# EAGLE design AbercrombieBlockage (EAGLE 7.4.0)
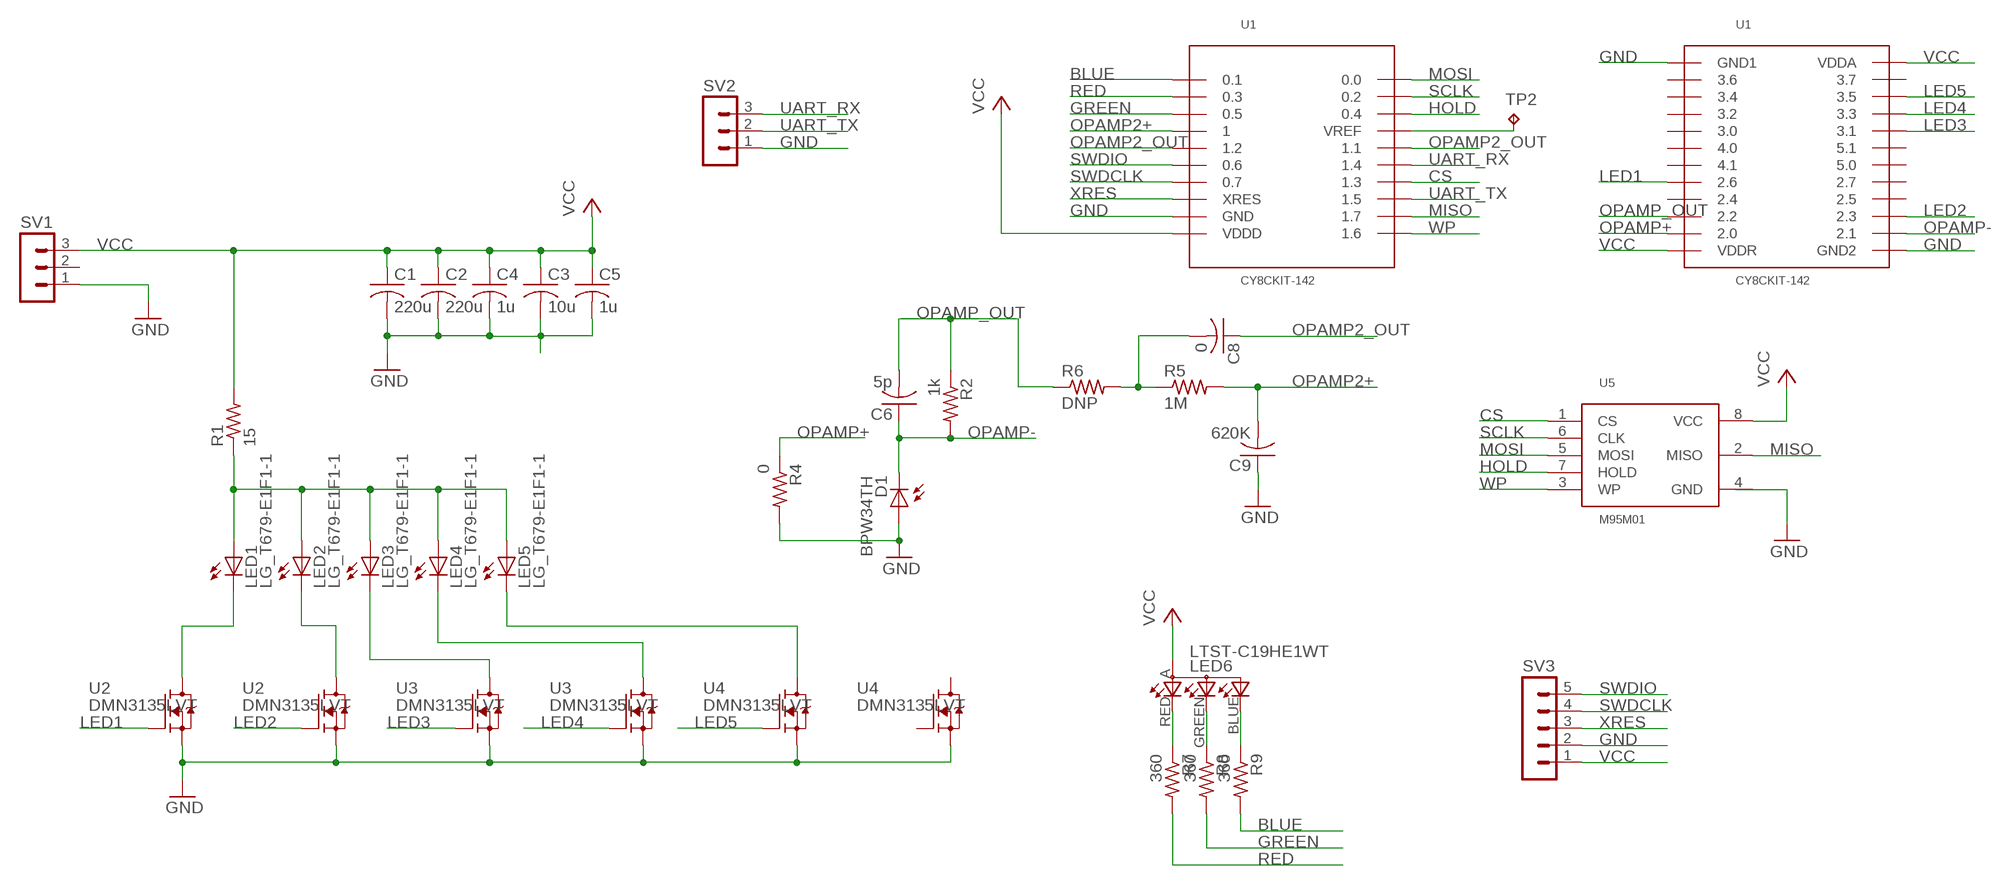
[diagram p0: schematic, sheet 1]

## Parts
C1  220u  C-USC1210  [C1210]
C2  220u  C-USC1210  [C1210]
C3  10u  C-USC1210  [C1210]
C4  1u  C-USC0603  [C0603]
C5  1u  C-USC0603  [C0603]
C6  5p  C-USC0603  [C0603]
C8  0  C-USC0603  [C0603]
C9  620K  C-USC0603  [C0603]
D1  BPW34TH  [BPW34]
LED1  LG_T679-E1F1-1  [PLCC2]
LED2  LG_T679-E1F1-1  [PLCC2]
LED3  LG_T679-E1F1-1  [PLCC2]
LED4  LG_T679-E1F1-1  [PLCC2]
LED5  LG_T679-E1F1-1  [PLCC2]
LED6  LTST-C19HE1WT  [LTST-C19HE1WT]
R1  15  R-US_R2010  [R2010]
R2  1k  R-US_R0603  [R0603]
R4  0  R-US_R0603  [R0603]
R5  1M  R-US_R0603  [R0603]
R6  DNP  R-US_R0603  [R0603]
R7  360  R-US_R0603  [R0603]
R8  360  R-US_R0603  [R0603]
R9  360  R-US_R0603  [R0603]
SV1  MA03-1  [MA03-1]
SV2  MA03-1  [MA03-1]
SV3  MA05-1  [MA05-1]
TP2  TPB1,27  [B1,27]
U1  CY8CKIT-142  [CY8CKIT-142]
U2  DMN3135LVT  [SOT-23-6]
U3  DMN3135LVT  [SOT-23-6]
U4  DMN3135LVT  [SOT-23-6]
U5  M95M01  [SO-08]

## Nets
BLUE: R9.2 U1.0.1
CS: U1.1.3 U5.1(CS)
GND: C1.2 C2.2 C3.2 C4.2 C5.2 C9.1 D1.A R4.2 SV1.1 SV2.1 SV3.2 U1.GND U1.GND1 U1.GND2 U2.2(S2) U2.5(S1) U3.2(S2) U3.5(S1) U4.2(S2) U4.5(S1)
GREEN: R8.2 U1.0.5
HOLD: U1.0.4 U5.7(HOLD)
LED1: U1.2.6 U2.1(G1)
LED2: U1.2.3 U2.3(G2)
LED3: U1.3.1 U3.1(G1)
LED4: U1.3.3 U3.3(G2)
LED5: U1.3.5 U4.1(G1)
MISO: U1.1.7 U5.2(MISO)
MOSI: U1.0.0 U5.5(MOSI)
N$1: LED1.A LED2.A LED3.A LED4.A LED5.A R1.1
N$2: LED1.C U2.6(D1)
N$3: LED2.C U2.4(D2)
N$4: LED3.C U3.6(D1)
N$5: LED4.C U3.4(D2)
N$6: LED5.C U4.6(D1)
N$7: C8.2 R5.1 R6.2
N$9: TP2.TP U1.VREF
N$10: LED6.RED(CRED) R7.1
N$11: LED6.GREEN(CGREEN) R8.1
N$13: LED6.BLUE(CBLUE) R9.1
OPAMP2+: C9.2 R5.2 U1.1
OPAMP2_OUT: C8.1 U1.1.1 U1.1.2
OPAMP+: R4.1 U1.2.0
OPAMP-: C6.1 D1.C R2.2 U1.2.1
OPAMP_OUT: C6.2 R2.1 R6.1 U1.2.2
RED: R7.2 U1.0.3
SCLK: U1.0.2 U5.6(CLK)
SWDCLK: SV3.4 U1.0.7
SWDIO: SV3.5 U1.0.6
UART_RX: SV2.3 U1.1.4
UART_TX: SV2.2 U1.1.5
VCC: C1.1 C2.1 C3.1 C4.1 C5.1 LED6.A R1.2 SV1.3 SV3.1 U1.VDDA U1.VDDD U1.VDDR U5.8(VCC)
WP: U1.1.6 U5.3(WP)
XRES: SV3.3 U1.XRES
Unconnected: SV1.2 U1.2.4 U1.2.5 U1.2.7 U1.3.0 U1.3.2 U1.3.4 U1.3.6 U1.3.7 U1.4.0 U1.4.1 U1.5.0 U1.5.1 U4.3(G2) U4.4(D2)

## Power pins joined to a net without a drawn wire
GND: U5.4(GND)

## Library data of the parts
C1-C6 C8 C9 = resistor:C-US: CAPACITOR, American symbol
D1 = NicksParts:BPW34: PIN Photodiode
LED1 = led:*_T679-?-1: LC TOPLED® Low Current LED Source: http://catalog.osram-os.com .. LG_LS_LY_T679_OBS.pdf; COLOR: green; DIGIKEY: VSMY3850-GS08CT-ND; DIGIKEY2: VSMY2850GCT-ND
LED2-LED5 = led:*_T679-?-1: LC TOPLED® Low Current LED Source: http://catalog.osram-os.com .. LG_LS_LY_T679_OBS.pdf; COLOR: green; DIGIKEY: VSMY3850-GS08CT-ND
LED6 = NicksParts:LTST-C19HE1WT
R1 = resistor:R-US_: RESISTOR, American symbol; DIGIKEY_100_OHM: YAG3381CT-ND; DIGIKEY_30_OHM: RHM30BGCT-ND; DIGIKEY_50_OHM: 541-2477-1-ND
R2 R4-R9 = resistor:R-US_: RESISTOR, American symbol
SV1 SV2 = con-lstb:MA03-1: PIN HEADER; OC_FARNELL: unknown; OC_NEWARK: unknown
SV3 = con-lstb:MA05-1: PIN HEADER; OC_FARNELL: unknown; OC_NEWARK: unknown
TP2 = testpad:TP: Test pad
U1 = NicksParts:CY8CKIT-142: PSoC 4 BLE Kit Connectors: S9189-ND (24 pin) S9188-ND (20 pin)
U2-U4 = NicksParts:DMN3135LVT; DIGIKEY: DMN3135LVT-7DICT-ND
U5 = NicksParts:M95M01: ST SPI based EEPROM; DIGIKEY: 497-14359-1-ND

## Board
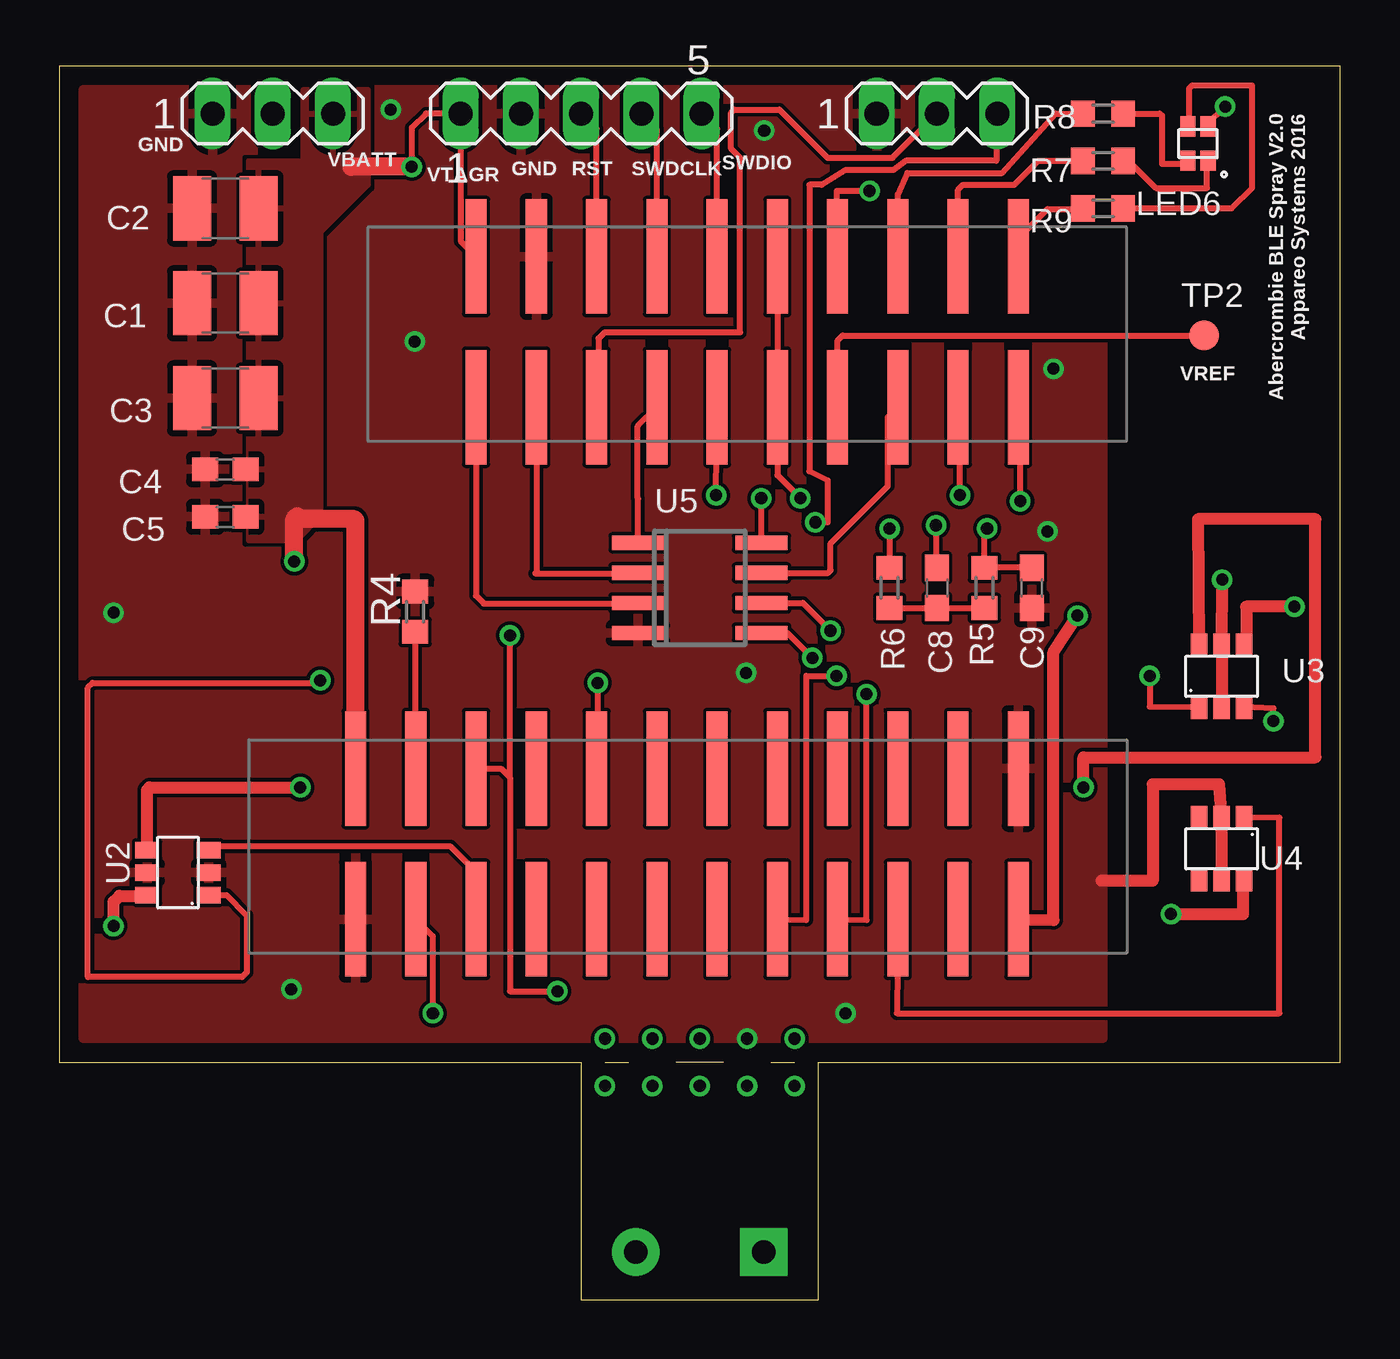
[diagram p1: board, top side]
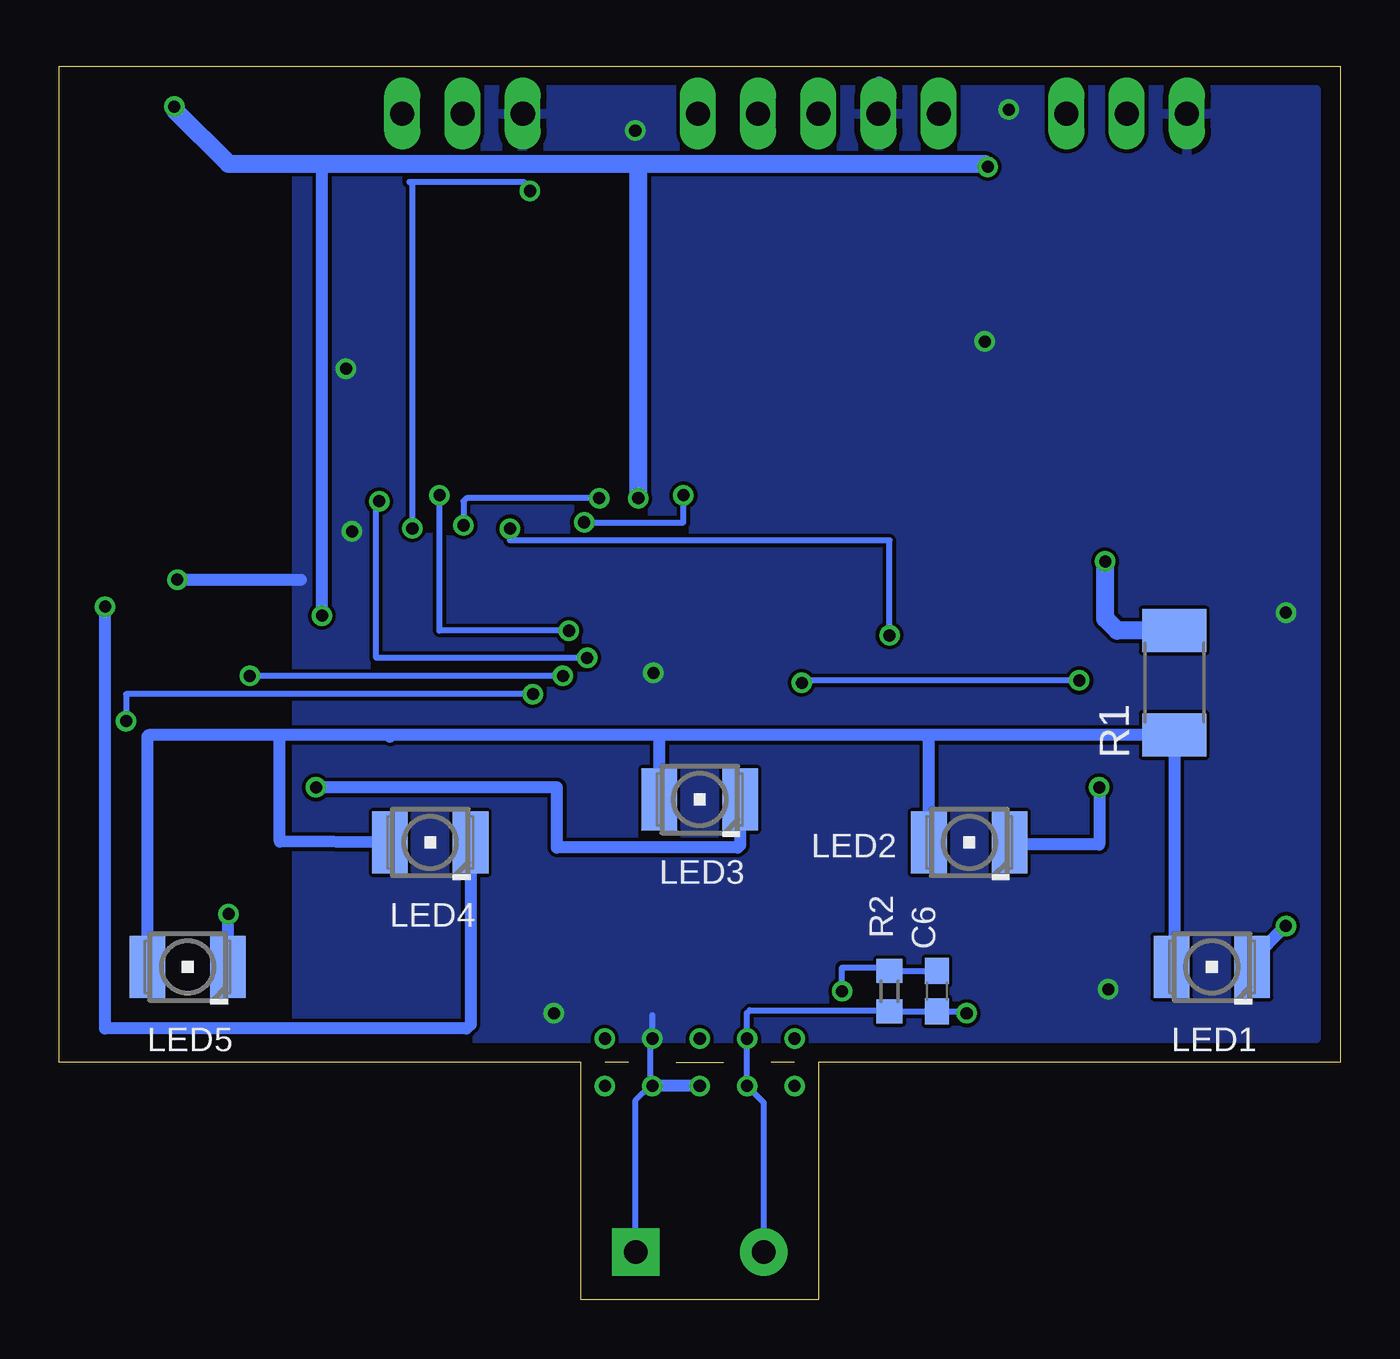
[diagram p2: board, bottom side, seen from below]

Size 54 x 52 mm. Coordinates in mm from the lower left corner, seen from the top.
Outline: 23,10 24,10
Outline: 28,10 26,10
Outline: 30,10 31,10
Outline: 0,10 22,10 22,0 32,0 32,10 54,10 54,52 0,52 0,10
Copper layers (1*16): Top 0.0356mm / dielectric 1.5011mm / Bottom 0.0356mm
Design rules "oshpark-2layer": minimum track width 6mil, minimum drill 13mil, track to track 6mil, track to pad 6mil, pad to pad 6mil, via to via 6mil, smd to smd 6mil, copper to edge 15mil, drill to drill 6mil, minimum pad ring 7mil, minimum via ring 7mil, stop-mask expansion 4mil, vias tented up to drill 0mil, thermal gap 10mil

### Footprints (pad centres in the part's own frame; a part is rotated, then mirrored left to right if it is on the bottom)
C1210 = smd 1.6 x 2.7: 1 -1.4,0; 2 1.4,0
C0603 = smd 1.1 x 1: 1 -0.85,0; 2 0.85,0
BPW34 = drill 1 pad 2 square: A -2.7,0 | drill 1 pad 2: C 2.7,0
PLCC2 = smd 2.6 x 1.5: A 0,1.7; C 0,-1.7
LTST-C19HE1WT = smd 0.65 x 0.85: A -0.425,-0.725; BLUE 0.425,-0.725; GREEN 0.425,0.725; RED -0.425,0.725
R2010 = smd 1.8 x 2.7: 1 -2.2,0; 2 2.2,0
R0603 = smd 1 x 1.1: 1 -0.85,0; 2 0.85,0
MA03-1 = drill 1.016 long: 1 -2.54,0; 2 0,0; 3 2.54,0
MA05-1 = drill 1.016 long: 1 -5.08,0; 2 -2.54,0; 3 0,0; 4 2.54,0; 5 5.08,0
B1,27 = smd 1.27 x 1.27: TP 0,0
CY8CKIT-142 = smd 4.826 x 0.889: 0.0 -7.62,11.43; 0.1 -13.97,11.43; 0.2 -7.62,8.89; 0.3 -13.97,8.89; 0.4 -7.62,6.35; 0.5 -13.97,6.35; 0.6 -13.97,-1.27; 0.7 -13.97,-3.81; 1 -13.97,3.81; 1.1 -7.62,1.27; 1.2 -13.97,1.27; 1.3 -7.62,-3.81; 1.4 -7.62,-1.27; 1.5 -7.62,-6.35; 1.6 -7.62,-11.43; 1.7 -7.62,-8.89; 2.0 7.62,-13.97; 2.1 13.97,-13.97; 2.2 7.62,-11.43; 2.3 13.97,-11.43; 2.4 7.62,-8.89; 2.5 13.97,-8.89; 2.6 7.62,-6.35; 2.7 13.97,-6.35; 3.0 7.62,1.27; 3.1 13.97,1.27; 3.2 7.62,3.81; 3.3 13.97,3.81; 3.4 7.62,6.35; 3.5 13.97,6.35; 3.6 7.62,8.89; 3.7 13.97,8.89; 4.0 7.62,-1.27; 4.1 7.62,-3.81; 5.0 13.97,-3.81; 5.1 13.97,-1.27; GND -13.97,-8.89; GND1 7.62,11.43; GND2 13.97,-16.51; VDDA 13.97,11.43; VDDD -13.97,-11.43; VDDR 7.62,-16.51; VREF -7.62,3.81; XRES -13.97,-6.35
SOT-23-6 = smd 0.7 x 1: 1 -0.95,-1.3; 2 0,-1.3; 3 0.95,-1.3; 4 0.95,1.3; 5 0,1.3; 6 -0.95,1.3
SO-08 = smd 0.6 x 2.2: 1 -1.905,-2.6; 2 -0.635,-2.6; 3 0.635,-2.6; 4 1.905,-2.6; 5 1.905,2.6; 6 0.635,2.6; 7 -0.635,2.6; 8 -1.905,2.6

### Placement (x,y rotation side)
C1  7,42 180 top
C2  7,46 180 top
C3  7,38 180 top
C4  7,35 180 top
C5  7,33 180 top
C6  17,13 90 bottom
C8  37,30 270 top
C9  41,30 90 top
D1  27,2 0 bottom
LED1  5.41,14.02 90 bottom
LED2  15.64,19.27 90 bottom
LED3  27,21.08 90 bottom
LED4  38.36,19.27 90 bottom
LED5  48.59,14.02 90 bottom
LED6  48,48.73 180 top
R1  7,26 90 bottom
R2  19,13 270 bottom
R4  15,29 90 top
R5  39,30 90 top
R6  35,30 270 top
R7  44,48 180 top
R8  44,50 180 top
R9  44,46 180 top
SV1  9,50 0 top
SV2  37,50 0 top
SV3  22,50 0 top
TP2  48.26,40.64 0 top
U1  29,30 270 top
U2  5,18 90 top
U3  49,26.27 0 top
U4  49,19 180 top
U5  27,30 270 top

### Tracks (layer width: path | path; a pad name or v marks a point on that pad's centre or on a via)
BLUE
  Top 0.254: U1.0.1 40.43,44.75 41.66,45.97 43.12,45.97 R9.2
CS
  Top 0.254: U5.1 24.4,33.77 24.38,33.78 24.38,36.81 U1.1.3
GND  (via drill 0.51)
  Top 0.508: U4.5 U4.2 48.9,21.72 46.1,21.72 46.1,17.65 43.94,17.65 | U3.2 U3.5 v49.02,30.35
  Bottom 0.254: D1.A 29.7,8.4 29.08,9.02 29.08,10.92 v29,11 29,12
  Bottom 0.508: v49.02,30.35 43.81,30.35 | v27,9 29.08,9.02 | SV3.2 19.43,51.31
  other vias: 41.66,32.38 28.96,26.42 41.91,39.24 14.99,40.39 13.97,50.16 2.29,28.96 9.78,13.08 33.15,12.06 29.72,49.28
  pour Top (rank 2): 1,51 1,11 44,11 44,51
  pour Bottom: 1,51 1,11 44,11 44,51
GREEN
  Top 0.254: U1.0.5 35.35,46.59 35.75,47.49 39.75,47.49 42,50 R8.2
HOLD
  Top 0.254: U5.7 32.41,30.64 32.51,30.73 32.51,31.88 34.92,34.29 34.92,37.2 U1.0.4
LED1  (via drill 0.51)
  Top 0.254: U2.1 7.05,17.05 7.9,16.2 7.9,13.8 7.7,13.6 1.2,13.6 1.2,25.8 1.4,26 10.9,26 v11,26.1 | v22.7,26 22.7,22.43 U1.2.6
  Bottom 0.254: v11,26.1 22.6,26.1 v22.7,26
LED2
  Top 0.254: U1.2.3 17.57,18.03 16.5,19.1 6.45,19.1 U2.3
LED3  (via drill 0.51)
  Top 0.254: U1.3.1 31.5,16 31.5,26.29 v32.77,26.29 | v45.97,26.29 45.97,24.99 U3.1
  Bottom 0.254: v32.77,26.29 v45.97,26.29
LED4  (via drill 0.51)
  Top 0.254: U1.3.3 34.04,16 v34.04,25.53 | v51.18,24.38 51.18,24.92 U3.3
  Bottom 0.254: v34.04,25.53 51.18,25.53 v51.18,24.38
LED5
  Top 0.254: U1.3.5 35.31,12.06 51.44,12.06 51.44,20.32 U4.1
MISO
  Top 0.254: U1.1.7 20.11,30.65 20.07,30.61 24.37,30.61 U5.2
MOSI  (via drill 0.51)
  Top 0.254: U5.5 30.71,28.09 v31.75,27.05 | v40.51,33.66 40.51,37.54 U1.0.0
  Bottom 0.254: v31.75,27.05 40.64,27.05 40.64,33.53 v40.51,33.66
N$1
  Bottom 0.508: LED1.A 7,14.13 R1.1 17.53,23.8 | 17.53,23.8 28.7,23.8 | 28.7,23.8 40.13,23.8 | 40.13,23.8 44.7,23.8 | 44.7,23.8 50.24,23.8 50.29,23.75 LED5.A | 40.06,23.73 40.13,23.8 | LED3.A 28.7,23.8 | LED2.A 17.34,23.61 17.53,23.8 | LED4.A 44.7,19.3 44.7,23.8
N$2  (via drill 0.51)
  Top 0.508: v2.29,15.75 2.29,16.76 2.54,17.02 3.67,17.02 U2.6
  Bottom 0.508: LED1.C 3.71,14.32 v2.29,15.75
N$3  (via drill 0.51)
  Top 0.508: U2.4 3.7,21.48 3.81,21.59 v10.16,21.59
  Bottom 0.508: v10.16,21.59 10.16,19.18 13.85,19.18 LED2.C
N$4  (via drill 0.51)
  Top 0.508: v43.18,21.59 43.18,22.86 52.96,22.86 52.96,32.89 48.01,32.89 U3.6
  Bottom 0.508: LED3.C 25.3,19.15 25.4,19.05 33.02,19.05 33.02,21.59 v43.18,21.59
N$5  (via drill 0.51)
  Top 0.508: v52.07,29.21 50.04,29.21 50.04,27.66 U3.4
  Bottom 0.508: LED4.C 36.66,11.6 36.83,11.43 52.07,11.43 v52.07,29.21
N$6  (via drill 0.51)
  Top 0.508: v46.86,16.26 49.91,16.26 49.91,17.66 U4.6
  Bottom 0.508: LED5.C 46.89,16.23 v46.86,16.26
N$7
  Top 0.254: R6.2 C8.2 R5.1
N$8  (via drill 0.51)
  other vias: 23,9
N$9
  Top 0.254: U1.VREF 32.81,40.43 33.02,40.64 TP2.TP
N$10
  Top 0.254: R7.1 45.09,48 46.23,46.86 48.39,46.86 48.39,48.02 LED6.RED
N$11
  Top 0.254: R8.1 46.39,50 46.48,49.91 46.48,47.88 47.45,47.88 LED6.GREEN
N$12  (via drill 0.51)
  other vias: 25,9
N$13
  Top 0.254: R9.1 49.43,46 50.29,46.86 50.29,51.18 47.75,51.18 47.62,51.05 47.62,49.45 LED6.BLUE
N$15  (via drill 0.51)
  other vias: 29,9
N$16  (via drill 0.51)
  other vias: 31,9
N$17  (via drill 0.51)
  other vias: 31,11
N$19  (via drill 0.51)
  other vias: 27,11
N$20  (via drill 0.51)
  other vias: 25,11
N$21  (via drill 0.51)
  other vias: 23,11
OPAMP2+  (via drill 0.51)
  Top 0.254: C9.2 R5.2 39,32.4 v39.12,32.51 | v34.16,46.74 32.77,46.74 32.77,44.01 U1.1
  Bottom 0.254: v39.12,32.51 39.12,46.99 39.24,47.12 34.42,47.12 v34.16,46.74
OPAMP2_OUT  (via drill 0.51)
  Top 0.254: U1.1.2 U1.1.1 30.27,34.75 v31.24,33.78 | v36.96,32.64 36.96,30.89 C8.1
  Bottom 0.254: v31.24,33.78 36.83,33.78 36.96,33.66 v36.96,32.64
OPAMP+
  Top 0.254: R4.1 15,22.41 U1.2.0
OPAMP-  (via drill 0.51)
  Top 0.254: v15.75,12.06 15.75,15.31 U1.2.1
  Bottom 0.254: D1.C 24.3,8.3 25.02,9.02 25.02,12.06 24.89,12.19 19.04,12.19 R2.2 C6.1 15.83,12.15 v15.75,12.06
OPAMP_OUT  (via drill 0.51)
  Top 0.254: U1.2.2 18.62,22.38 19,22 | 19,22 19,13 v21,13 | 19,22 v19,28 | v35,32.5 R6.1
  Bottom 0.254: C6.2 R2.1 19.15,14 21,14 v21,13 | v19,28 19,32 35,32 v35,32.5
RED
  Top 0.254: U1.0.3 37.89,46.78 38.1,46.99 40.26,46.99 41.27,48.01 R7.2
SCLK  (via drill 0.51)
  Top 0.254: U5.6 31.34,29.36 v32.51,28.19 | v37.97,33.91 37.97,37.54 U1.0.2
  Bottom 0.254: v32.51,28.19 37.97,28.19 v37.97,33.91
SWDCLK
  Top 0.254: U1.0.7 25.19,49.35 SV3.4
SWDIO
  Top 0.254: U1.0.6 27.73,49.35 SV3.5
UART_RX  (via drill 0.51)
  Top 0.254: 27.83,37.72 U1.1.4 v27.69,33.91 | SV2.3 39.5,48.01 35.69,48.01 35.18,47.62 33.15,47.62 32.13,46.99 31.62,46.99 31.62,34.92 32.38,34.54 32.38,32.77 v31.88,32.77
  Bottom 0.254: v31.88,32.77 27.69,32.77 v27.69,33.91
UART_TX
  Top 0.254: 37,49.95 SV2.2 35.13,48.13 32.38,48.13 30.35,50.16 28.45,50.16 28.32,50.04 28.32,48.51 28.7,48.13 28.7,40.77 22.99,40.77 22.73,40.51 22.73,37.7 U1.1.5
VCC  (via drill 0.51)
  Top 0.254: U1.VDDD 16.92,44.62 SV3.1 15.46,50 14.86,49.4 v14.86,47.75 | U5.8 v29.6,33.77 v29.59,33.78 | 12.32,47.75 12.19,47.62 | LED6.A 48.4,49.54 v49.15,50.29
  Top 0.508: U1.VDDA 41.91,16 41.91,27.3 v42.93,28.83
  Top 0.762: v14.86,47.75 12.32,47.75 | v9.91,31.11 9.91,32.89 10.03,33.02 10.16,32.89 12.45,32.89 12.49,32.85 U1.VDDR
  Bottom 0.254: 29.59,47.75 29.72,47.88 | 14.99,47.88 v14.86,47.75 | v49.15,50.29 49.15,50.16
  Bottom 0.508: v42.93,28.83 42.93,47.88
  Bottom 0.762: v29.59,33.78 29.59,47.75 | 14.99,47.88 29.72,47.88 42.93,47.88 46.86,47.88 49.15,50.16 | R1.2 9.4,28.2 9.91,28.7 v9.91,31.11
  pour Top: 11,51 13,51 13,47 11,45 11,33 10,32 8,32 8,48 10,48 10.3,48 10.3,51 10.8,51 10.9,50.9
WP
  Top 0.254: U1.1.6 17.57,29.67 17.91,29.34 24.37,29.34 U5.3
XRES
  Top 0.254: U1.XRES 22.65,49.35 SV3.3

### Text on the board
tNames: Abercrombie BLE Spray V2.0 / Appareo Systems 2016 | GND | VBATT | SWDIO | VTAGR | GND | RST | SWDCLK | VREF